# EAGLE design smd-v1 (EAGLE 5.11)

## Sheet 1 of 2
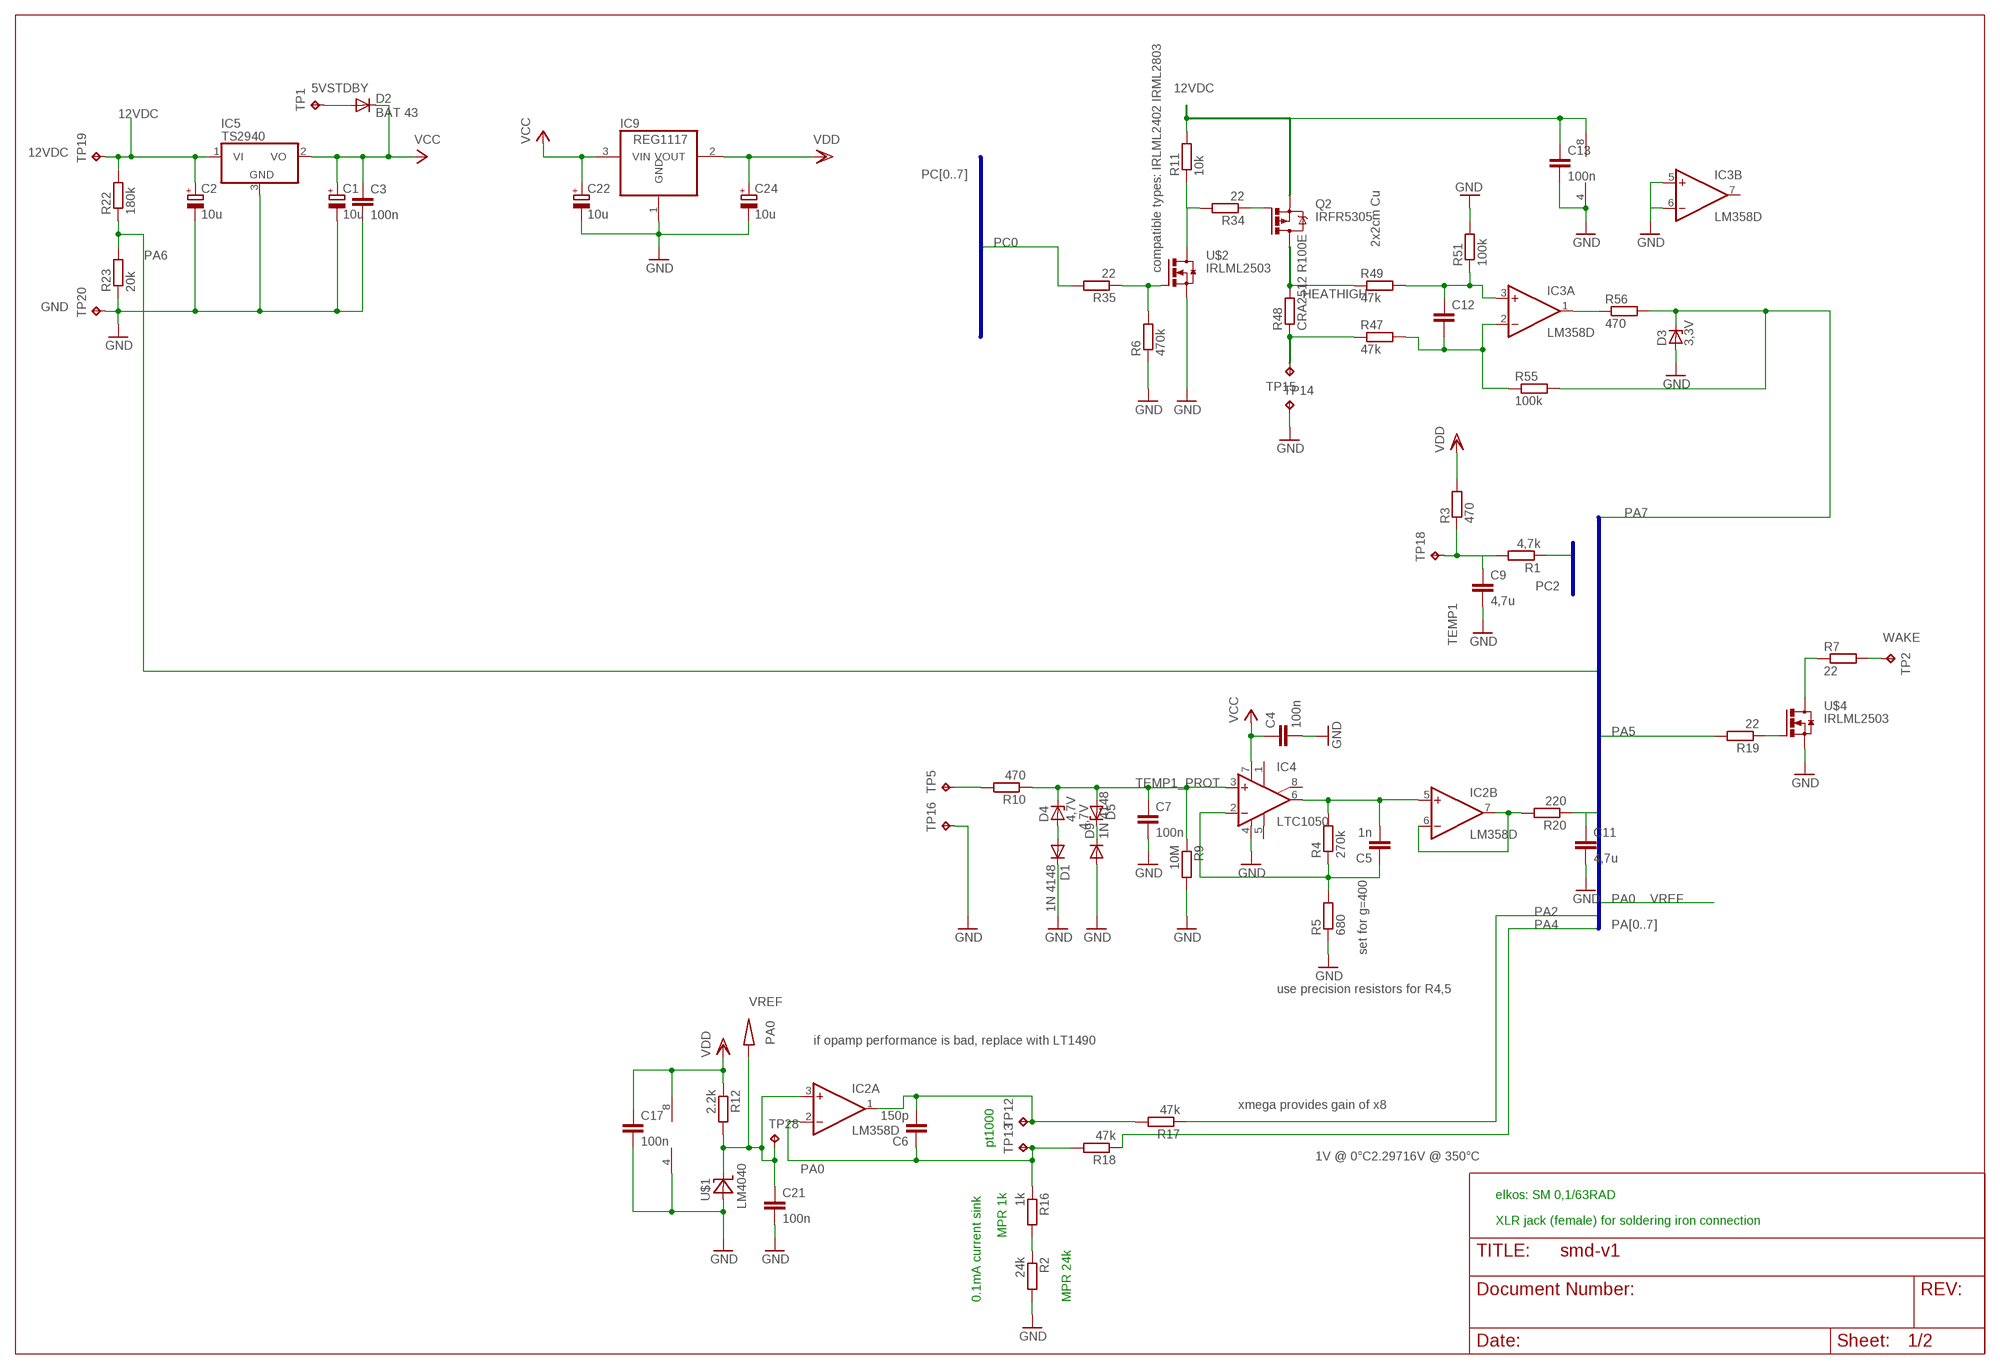
[diagram p0: schematic, sheet 1]

### Parts
C1  10u  CPOL-EUC/6032-28R  [C/6032-28R]
C2  10u  CPOL-EUC/6032-28R  [C/6032-28R]
C3  100n  C-EUC0805  [C0805]
C4  100n  C-EUC0805  [C0805]
C5  1n  C-EUC0805  [C0805]
C6  150p  C-EUC0805  [C0805]
C7  100n  C-EUC0805  [C0805]
C9  4,7u  C-EUC0805  [C0805]
C11  4,7u  C-EUC0805  [C0805]
C12  C-EUC0603  [C0603]
C13  100n  C-EUC0805  [C0805]
C17  100n  C-EUC0805  [C0805]
C21  100n  C-EUC0805  [C0805]
C22  10u  CPOL-EUC/6032-28R  [C/6032-28R]
C24  10u  CPOL-EUC/6032-28R  [C/6032-28R]
D1  1N 4148  DIODE-MINIMELF  [MINIMELF]
D2  BAT 43  DIODE-MINIMELF  [MINIMELF]
D3  3,3V  ZENER-DIODESOT23  [SOT23]
D4  4,7V  ZENER-DIODESOD80C  [SOD80C]
D5  4,7V  ZENER-DIODESOD80C  [SOD80C]
D9  1N 4148  DIODE-MINIMELF  [MINIMELF]
IC2  LM358D  [SO08]
IC3  LM358D  [SO08]
IC4  LTC1050  LM101D  [SO08]
IC5  TS2940  7805DT  [TO252]
IC9  REG1117  [SOT223]
Q2  IRFR5305  [D-PAK_TO252AA]
R1  4,7k  R-EU_R0805  [R0805]
R2  24k  R-EU_R0805  [R0805]
R3  470  R-EU_R0805  [R0805]
R4  270k  R-EU_R0805  [R0805]
R5  680  R-EU_R0805  [R0805]
R6  470k  R-EU_R0805  [R0805]
R7  22  R-EU_R0805  [R0805]
R9  10M  R-EU_R0805  [R0805]
R10  470  R-EU_R0805  [R0805]
R11  10k  R-EU_R0805  [R0805]
R12  2.2k  R-EU_R0805  [R0805]
R16  1k  R-EU_R0805  [R0805]
R17  47k  R-EU_R0805  [R0805]
R18  47k  R-EU_R0805  [R0805]
R19  22  R-EU_R0805  [R0805]
R20  220  R-EU_R0805  [R0805]
R22  180k  R-EU_R0805  [R0805]
R23  20k  R-EU_R0805  [R0805]
R34  22  R-EU_R0805  [R0805]
R35  22  R-EU_R0805  [R0805]
R47  47k  R-EU_R0603  [R0603]
R48  CRA2512 R100E  R-EU_R2512  [R2512]
R49  47k  R-EU_R0603  [R0603]
R51  100k  R-EU_R0603  [R0603]
R55  100k  R-EU_R0603  [R0603]
R56  470  R-EU_R0603  [R0603]
TP1  TPTP20SQ  [TP20SQ]
TP2  TPTP20SQ  [TP20SQ]
TP5  TPTP20SQ  [TP20SQ]
TP12  TPTP20SQ  [TP20SQ]
TP13  TPTP20SQ  [TP20SQ]
TP14  TPTP20SQ  [TP20SQ]
TP15  TPTP20SQ  [TP20SQ]
TP16  TPTP20SQ  [TP20SQ]
TP18  TPTP20SQ  [TP20SQ]
TP19  TPTP20SQ  [TP20SQ]
TP20  TPTP20SQ  [TP20SQ]
TP28  TPTP20SQ  [TP20SQ]
U$1  LM4040  [SOT23]
U$2  IRLML2503  [MICRO3]
U$4  IRLML2503  [MICRO3]

### Nets
12VDC: C2.+ C13.1 IC3.8(P:V+) IC5.1(VI) Q2.3(S) R11.2 R22.2 TP19.TP
GND: C1.- C2.- C3.2 C4.2 C7.2 C9.2 C11.2 C13.2 C17.2 C21.2 C22.- C24.- D1.C D3.1(A) D9.A IC2.4(P:V-) IC3.4(P:V-) IC3.5(B:+IN) IC3.6(B:-IN) IC4.4(V-) IC5.3(GND) IC9.1(GND) R2.2 R5.1 R6.1 R9.2 R23.1 R51.2 TP14.TP TP16.TP TP20.TP U$1.2(A) U$2.2(S) U$4.2(S) ; also sheet 2
HEATHIGH: Q2.4(D) R48.2 R49.1
N$2: R11.1 R34.2 U$2.3(D)
N$4: C6.2 IC2.1(A:OUT) R17.2 TP12.TP
N$5: R2.1 R16.2
N$6: D1.A D4.A
N$7: R7.1 U$4.3(D)
N$8: R19.1 U$4.1(G)
N$10: Q2.1(G) R34.1
N$12: C6.1 IC2.2(A:-IN) R16.1 R18.2 TP13.TP
N$13: D5.C D9.C
N$14: D2.A TP1.TP
N$15: C5.1 IC4.2(-IN) R4.1 R5.2
N$34: R6.2 R35.1 U$2.1(G)
N$066: R47.1 R48.1 TP15.TP
N$067: C12.1 IC3.3(A:+IN) R49.2 R51.1
N$068: C12.2 IC3.2(A:-IN) R47.2 R55.1
N$073: IC3.1(A:OUT) R56.1
N$075: IC2.6(B:-IN) IC2.7(B:OUT) R20.2
N$085: C5.2 IC2.5(B:+IN) IC4.6(OUT) R4.2
PA0: C21.1 IC2.3(A:+IN) R12.2 TP28.TP U$1.1(C) ; supply symbol labelled MARKER_OUTPUT ; also sheet 2
PA1: C11.1 R20.1 ; also sheet 2
PA2: R17.1 ; also sheet 2
PA4: R18.1 ; also sheet 2
PA5: R19.2 ; also sheet 2
PA6: R22.1 R23.2 ; also sheet 2
PA7: D3.3(C) R55.2 R56.2 ; also sheet 2
PC0: R35.2 ; also sheet 2
PC2: R1.1 ; also sheet 2
TEMP1: R10.2 TP5.TP
TEMP1_PROT: C7.1 D4.C D5.A IC4.3(+IN) R9.1 R10.1
TRAY1: C9.1 R1.2 R3.1 TP18.TP
VCC: C1.+ C3.1 C4.1 C22.+ D2.C IC4.7(V+) IC5.2(VO) IC9.3(VIN) ; also sheet 2
VDD: C17.1 C24.+ IC2.8(P:V+) IC9.2(VOUT) R3.2 R12.1 ; also sheet 2
WAKEXXX: R7.2 TP2.TP
Unconnected: IC3.7(B:OUT) IC4.1(ON1) IC4.5(OPT) IC4.8(ON2)

### Buses
PA[0..7]
PC[0..7]
PC2

### Notes on the sheet
- 5VSTDBY
- 12VDC
- 2x2cm Cu
- compatible types: IRLML2402 IRML2803
- GND
- WAKE
- VREF
- set for g=400
- use precision resistors for R4,5
- VREF
- if opamp performance is bad, replace with LT1490
- xmega provides gain of x8
- pt1000
- 1V @ 0°C2.29716V @ 350°C
- elkos: SM 0,1/63RAD
- XLR jack (female) for soldering iron connection
- MPR 1k
- 0.1mA current sink | MPR 24k

## Sheet 2 of 2
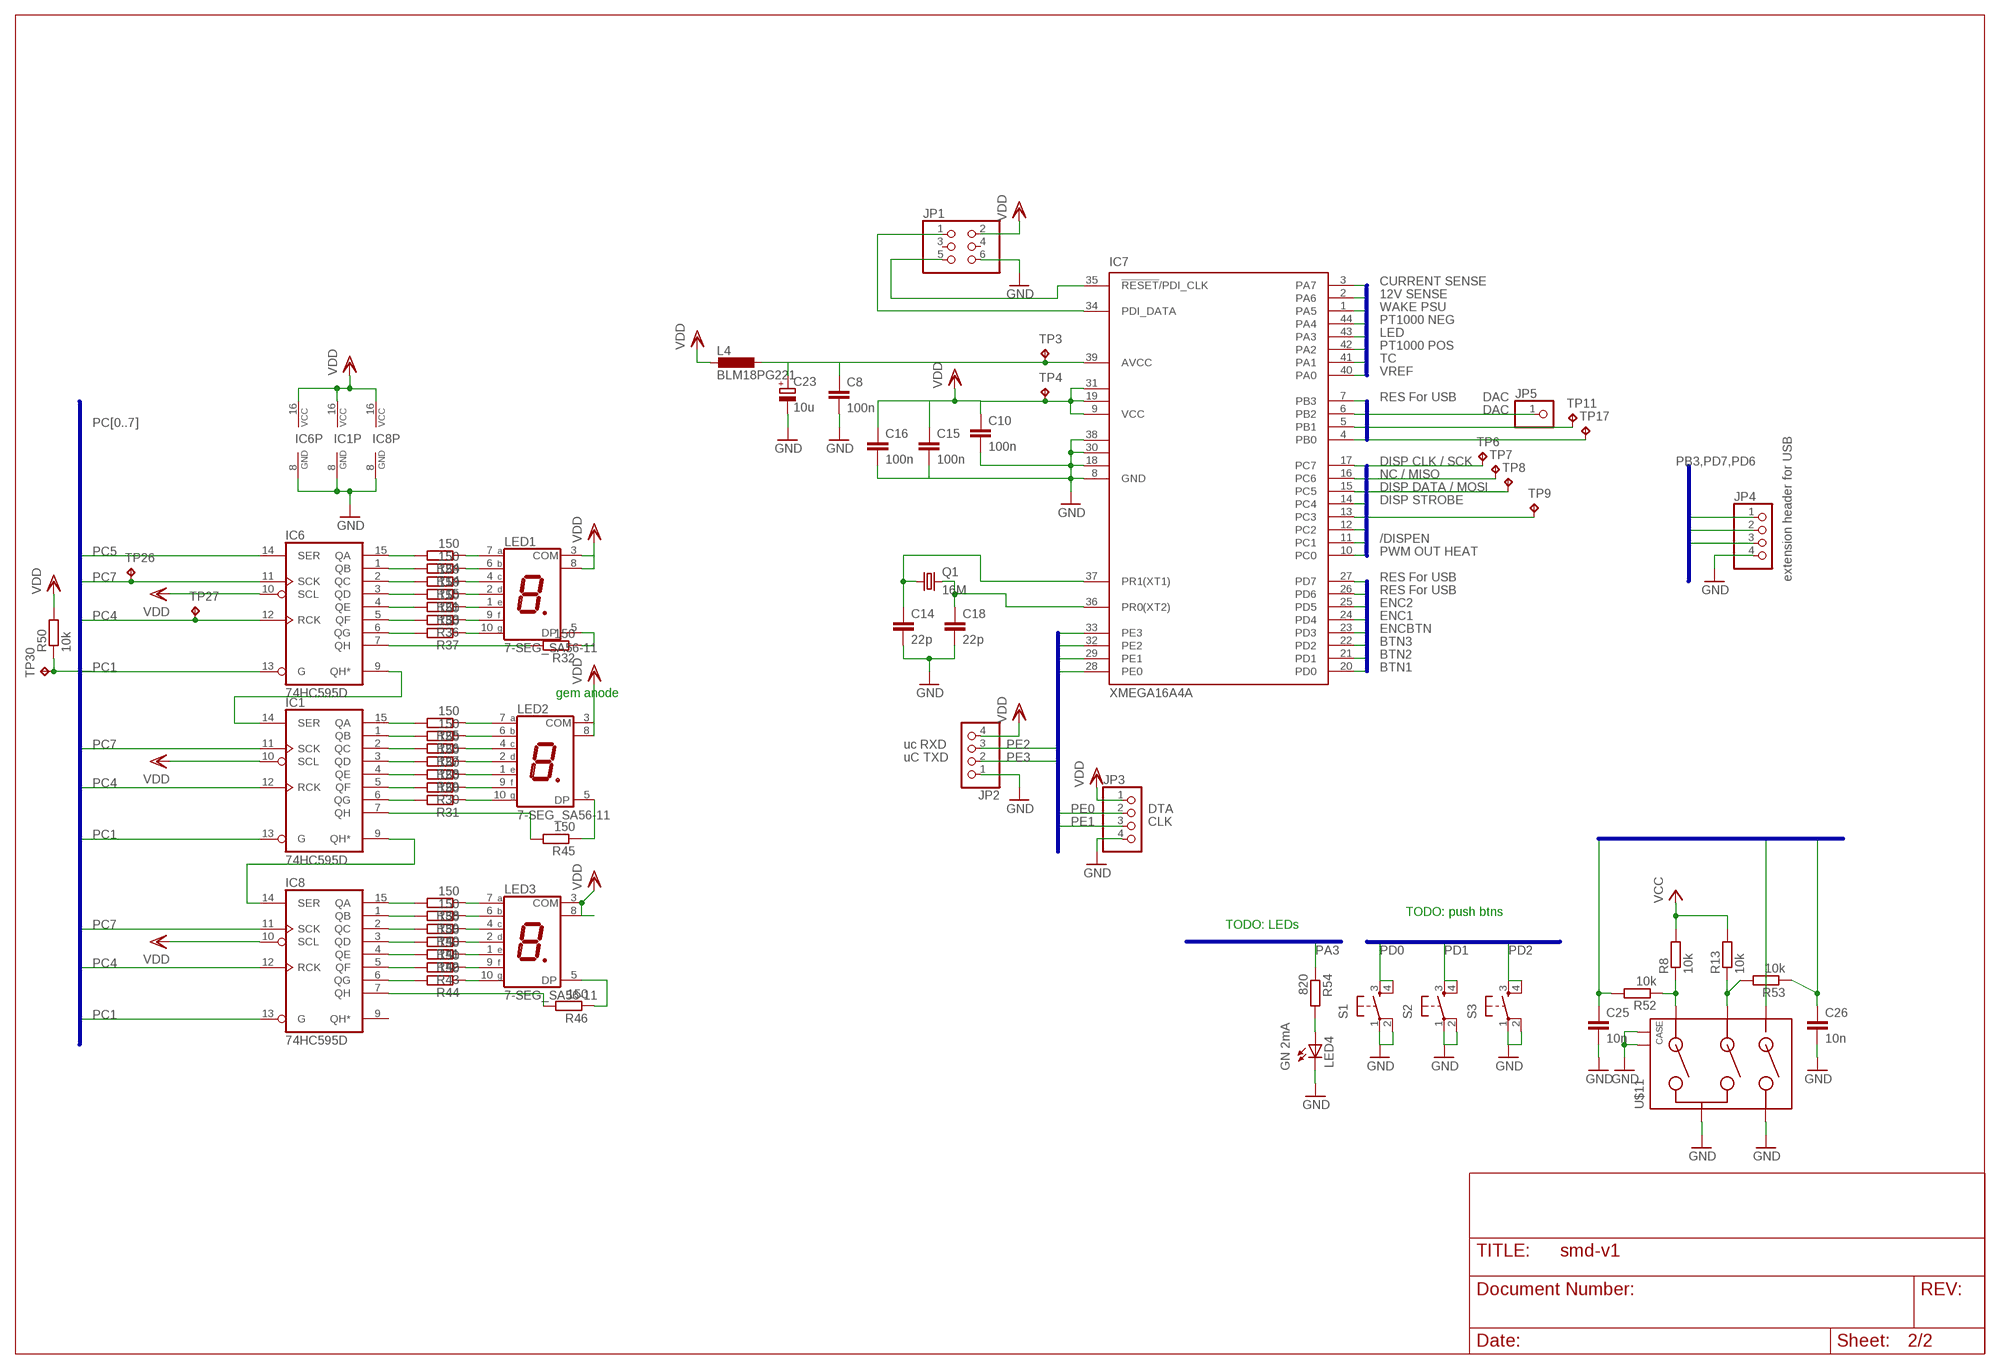
[diagram p1: schematic, sheet 2]

### Parts
C8  100n  C-EUC0603  [C0603]
C10  100n  C-EUC0603  [C0603]
C14  22p  C-EUC0805  [C0805]
C15  100n  C-EUC0603  [C0603]
C16  100n  C-EUC0603  [C0603]
C18  22p  C-EUC0805  [C0805]
C23  10u  CPOL-EU153CLV-0405  [153CLV-0405]
C25  10n  C-EUC0603  [C0603]
C26  10n  C-EUC0603  [C0603]
IC1  74HC595D  [SO16]
IC6  74HC595D  [SO16]
IC7  XMEGA16A4A  [TQFP44]
IC8  74HC595D  [SO16]
JP1  PINHD-2X3  [2X03]
JP2  PINHD-1X4  [1X04]
JP3  PINHD-1X4  [1X04]
JP4  PINHD-1X4  [1X04]
JP5  PINHD-1X1  [1X01]
L4  BLM18PG221  L-EUL0603  [L0603]
LED1  7-SEG_SA56-11  [SA56-11]
LED2  7-SEG_SA56-11  [SA56-11]
LED3  7-SEG_SA56-11  [SA56-11]
LED4  LEDCHIP-LED0603  [CHIP-LED0603]
Q1  16M  CRYSTALHC49UP  [HC49UP]
R8  10k  R-EU_R0603  [R0603]
R13  10k  R-EU_R0603  [R0603]
R14  150  R-EU_R0805  [R0805]
R15  150  R-EU_R0805  [R0805]
R21  150  R-EU_R0805  [R0805]
R24  150  R-EU_R0805  [R0805]
R25  150  R-EU_R0805  [R0805]
R26  150  R-EU_R0805  [R0805]
R27  150  R-EU_R0805  [R0805]
R28  150  R-EU_R0805  [R0805]
R29  150  R-EU_R0805  [R0805]
R30  150  R-EU_R0805  [R0805]
R31  150  R-EU_R0805  [R0805]
R32  150  R-EU_R0805  [R0805]
R33  150  R-EU_R0805  [R0805]
R36  150  R-EU_R0805  [R0805]
R37  150  R-EU_R0805  [R0805]
R38  150  R-EU_R0805  [R0805]
R39  150  R-EU_R0805  [R0805]
R40  150  R-EU_R0805  [R0805]
R41  150  R-EU_R0805  [R0805]
R42  150  R-EU_R0805  [R0805]
R43  150  R-EU_R0805  [R0805]
R44  150  R-EU_R0805  [R0805]
R45  150  R-EU_R0805  [R0805]
R46  150  R-EU_R0805  [R0805]
R50  10k  R-EU_R0805  [R0805]
R52  10k  R-EU_R0603  [R0603]
R53  10k  R-EU_R0603  [R0603]
R54  820  R-EU_R0603  [R0603]
S1  10-XXB3FRAFI  [RAFI]
S2  10-XXB3FRAFI  [RAFI]
S3  10-XXB3FRAFI  [RAFI]
TP3  TPTP20SQ  [TP20SQ]
TP4  TPTP20SQ  [TP20SQ]
TP6  TPTP20SQ  [TP20SQ]
TP7  TPTP20SQ  [TP20SQ]
TP8  TPTP20SQ  [TP20SQ]
TP9  TPTP20SQ  [TP20SQ]
TP11  TPTP20SQ  [TP20SQ]
TP17  TPTP20SQ  [TP20SQ]
TP26  TPTP20SQ  [TP20SQ]
TP27  TPTP20SQ  [TP20SQ]
TP30  TPTP20SQ  [TP20SQ]
U$11  STEC12E  [STEC12]

### Nets
FOO: C8.1 C23.+ IC7.39(AVCC) L4.1 TP3.TP
GND: C8.2 C10.2 C14.2 C15.2 C16.2 C18.2 C23.- C25.2 C26.2 IC1.8(GND) IC6.8(GND) IC7.8(GND) IC7.18(GND1) IC7.30(GND2) IC7.38(GND3) IC8.8(GND) JP1.6 JP2.1 JP3.4 JP4.4 LED4.C S1.1(P) S1.2(P1) S2.1(P) S2.2(P1) S3.1(P) S3.2(P1) U$11.P$2 U$11.P$5 U$11.P$6(CASE) U$11.P$7(CASE1) ; also sheet 1
N$1: R8.1 R52.1 U$11.P$1
N$3: IC6.15(QA) R24.2
N$11: LED2.5(DP) R45.1
N$16: IC1.15(QA) R25.2
N$17: C18.1 IC7.36(PR0(XT2)) Q1.2
N$18: IC1.1(QB) R26.2
N$19: C14.1 IC7.37(PR1(XT1)) Q1.1
N$20: IC1.2(QC) R27.2
N$21: IC1.3(QD) R28.2
N$22: IC1.4(QE) R29.2
N$23: IC1.5(QF) R30.2
N$24: IC1.6(QG) R31.2
N$25: IC1.7(QH) R45.2
N$26: LED2.7(A) R25.1
N$27: LED2.6(B) R26.1
N$28: LED2.4(C) R27.1
N$29: LED2.2(D) R28.1
N$30: LED2.1(E) R29.1
N$31: LED2.9(F) R30.1
N$32: LED2.10(G) R31.1
N$33: IC6.1(QB) R14.2
N$35: IC6.2(QC) R15.2
N$36: IC6.3(QD) R21.2
N$37: IC6.4(QE) R33.2
N$38: IC6.5(QF) R36.2
N$39: IC6.6(QG) R37.2
N$40: IC6.7(QH) R32.2
N$41: LED1.7(A) R24.1
N$42: LED1.6(B) R14.1
N$43: LED1.4(C) R15.1
N$44: LED1.2(D) R21.1
N$45: LED1.1(E) R33.1
N$46: LED1.9(F) R36.1
N$47: LED1.10(G) R37.1
N$48: IC8.15(QA) R38.2
N$49: IC8.1(QB) R39.2
N$50: IC8.2(QC) R40.2
N$51: IC8.3(QD) R41.2
N$52: IC8.4(QE) R42.2
N$53: IC8.5(QF) R43.2
N$54: IC8.6(QG) R44.2
N$55: IC8.7(QH) R46.2
N$56: LED3.7(A) R38.1
N$57: LED3.6(B) R39.1
N$58: LED3.4(C) R40.1
N$59: LED3.2(D) R41.1
N$60: LED3.1(E) R42.1
N$61: LED3.9(F) R43.1
N$62: LED3.10(G) R44.1
N$63: LED3.5(DP) R46.1
N$64: LED1.5(DP) R32.1
N$65: R13.1 R53.2 U$11.P$3
N$69: IC1.14(SER) IC6.9(QH*)
N$70: IC1.9(QH*) IC8.14(SER)
N$74: LED4.A R54.2
N$077: IC7.34(PDI_DATA) JP1.1
N$078: IC7.35(!RESET!/PDI_CLK) JP1.5
PA0: IC7.40(PA0) ; also sheet 1
PA1: IC7.41(PA1) ; also sheet 1
PA2: IC7.42(PA2) ; also sheet 1
PA3: IC7.43(PA3) R54.1
PA4: IC7.44(PA4) ; also sheet 1
PA5: IC7.1(PA5) ; also sheet 1
PA6: IC7.2(PA6) ; also sheet 1
PA7: IC7.3(PA7) ; also sheet 1
PB0: IC7.4(PB0) TP17.TP
PB1: IC7.5(PB1) TP11.TP
PB2: IC7.6(PB2) JP5.1
PB3: IC7.7(PB3) JP4.1
PC0: IC7.10(PC0) ; also sheet 1
PC1: IC1.13(G) IC6.13(G) IC7.11(PC1) IC8.13(G) R50.1 TP30.TP
PC2: IC7.12(PC2) ; also sheet 1
PC3: IC7.13(PC3) TP9.TP
PC4: IC1.12(RCK) IC6.12(RCK) IC7.14(PC4) IC8.12(RCK) TP27.TP
PC5: IC6.14(SER) IC7.15(PC5) TP8.TP
PC6: IC7.16(PC6) TP7.TP
PC7: IC1.11(SCK) IC6.11(SCK) IC7.17(PC7) IC8.11(SCK) TP6.TP TP26.TP
PD0: IC7.20(PD0) S1.3(S) S1.4(S1)
PD1: IC7.21(PD1) S2.3(S) S2.4(S1)
PD2: IC7.22(PD2) S3.3(S) S3.4(S1)
PD3: IC7.23(PD3) U$11.P$4
PD4: C25.1 IC7.24(PD4) R52.2
PD5: C26.1 IC7.25(PD5) R53.1
PD6: IC7.26(PD6) JP4.3
PD7: IC7.27(PD7) JP4.2
PE0: IC7.28(PE0) JP3.2
PE1: IC7.29(PE1) JP3.3
PE2: IC7.32(PE2) JP2.3
PE3: IC7.33(PE3) JP2.2
VCC: R8.2 R13.2 ; also sheet 1
VDD: C10.1 C15.1 C16.1 IC1.10(SCL) IC1.16(VCC) IC6.10(SCL) IC6.16(VCC) IC7.9(VCC) IC7.19(VCC1) IC7.31(VCC2) IC8.10(SCL) IC8.16(VCC) JP1.2 JP2.4 JP3.1 L4.2 LED1.3(COM) LED1.8(COM) LED2.3(COM) LED2.8(COM) LED3.3(COM) LED3.8(COM) R50.2 TP4.TP ; also sheet 1
Unconnected: IC8.9(QH*) JP1.3 JP1.4

### Buses
PA[0..7]
PD[0..7]
PB[0..3]
PC[0..7]
PE[0..3]
PB3,PD7,PD6

### Notes on the sheet
- CURRENT SENSE
- 12V SENSE
- WAKE PSU
- PT1000 NEG
- LED
- PT1000 POS
- TC
- VREF
- RES For USB | DAC
- DAC
- DISP CLK / SCK
- NC / MISO
- DISP DATA / MOSI
- DISP STROBE
- /DISPEN
- PWM OUT HEAT
- RES For USB | extension header for USB
- RES For USB
- ENC2
- ENC1
- ENCBTN
- BTN3
- BTN2
- BTN1
- gem anode
- uc RXD
- uC TXD
- DTA
- CLK
- TODO: push btns
- TODO: LEDs
- GN 2mA

## Library data of the parts
C1 C2 C22-C24 = rcl:CPOL-EU: POLARIZED CAPACITOR, European symbol
C3-C7 C9 C11 C13 C14 C17 C18 C21 = rcl:C-EU: CAPACITOR, European symbol
C8 C10 C12 C15 C16 C25 C26 = resistor:C-EU: CAPACITOR, European symbol
D1 D2 D9 = diode:DIODE-: DIODE
D3-D5 = diode:ZENER-DIODE: Z-Diode
IC1 IC6 IC8 = 74xx-eu:74*595: 8-bit SHIFT REGISTER, output latch
IC2 IC3 = linear:LM358: OP AMP also LM158; LM258; LM2904 Source: http://cache.national.com/ds/LM/LM158.pdf
IC4 = linear:LM101: OP AMP
IC5 = linear:78*: Positive VOLTAGE REGULATOR Source: http://cache.national.com/ds/LM/LM78L05.pdf http://www.fairchildsemi.com/ds/LM/LM7805.pdf
IC7 = atmel:XMEGA16A4: MICROCONTROLLER Features High-performance, Low-power 8/16-bit AVR XMEGA Microcontroller Non-Volatile Program and Data Memories - 16 KB - 128 KB of In-System Self-Programmable Flash - 4 KB - 8 KB Boot Code Section with Independent Lock Bits - 1 KB - 2 KB EEPROM - 2 KB - 8 KB Internal SRAM Peripheral Features - Four-channel DMA Controller with support for external requests - Eight-channel Event System - Five 16-bit Timer/Counters Three Timer/Counters with 4 Output Compare or Input Capture channels Two Timer/Counters with 2 Output Compare or Input Capture channels High-Resolution Extensions on all Timer/Counters Advanced Waveform Extension on one Timer/Counter - Five USARTs IrDA Extension on one USART - Two Two-Wire Interfaces with dual address match (I2C and SMBus compatible) - Two SPIs (Serial Peripheral Interfaces) peripherals - AES and DES Crypto Engine - 16-bit Real Time Counter with Separate Oscillator - One Twelve-channel, 12-bit, 2 Msps Analog to Digital Converter - One Two-channel, 12-bit, 1 Msps Digital to Analog Converter - Two Analog Comparators with Window compare function - External Interrupts on all General Purpose I/O pins - Programmable Watchdog Timer with Separate On-chip Ultra Low Power Oscillator Special Microcontroller Features - Power-on Reset and Programmable Brown-out Detection - Internal and External Clock Options with PLL - Programmable Multi-level Interrupt Controller - Sleep Modes: Idle, Power-down, Standby, Power-save, Extended Standby - Advanced Programming, Test and Debugging Interfaces PDI (Program and Debug Interface) for programming, test and debugging I/O and Packages - 34 Programmable I/O Lines - 44 - lead TQFP - 44 - pad VQFN/QFN - 49 - ball VFBGA Operating Voltage - 1.6 - 3.6V Speed performance - 0 - 12 MHz @ 1.6 - 3.6V - 0 - 32 MHz @ 2.7 - 3.6V Drawn by Dipl.-Ing. (FH) Robert Siegler Created: 27.05.09; OC_FARNELL: unknown; OC_NEWARK: unknown
IC9 = burr-brown:REG1117: 800mA and 1A Low Dropout (LDO) Positive Regulator 1.8V, 2.5V, 2.85V, 3.3V, 5V, and Adj; MPN: REG1117; OC_FARNELL: 1097566; OC_NEWARK: 14P6981
JP1 = pinhead:PINHD-2X3: PIN HEADER
JP2-JP4 = pinhead:PINHD-1X4: PIN HEADER
JP5 = pinhead:PINHD-1X1: PIN HEADER
L4 = rcl:L-EU: INDUCTOR, European symbol
LED1-LED3 = display-kingbright:7-SEG_: Kingbright 14.2mm (0.56 INCH) SINGLE DIGIT NUMERIC DUISPLAY Source: SA56-11EWA(Ver1189471036.pdf; OC_FARNELL: unknown; OC_NEWARK: unknown
LED4 = led:LED: LED OSRAM: - CHIPLED LG R971, LG N971, LY N971, LG Q971, LY Q971, LO R971, LY R971 LH N974, LH R974 LS Q976, LO Q976, LY Q976 LO Q996 - Hyper CHIPLED LW Q18S LB Q993, LB Q99A, LB R99A - SideLED LS A670, LO A670, LY A670, LG A670, LP A670 LB A673, LV A673, LT A673, LW A673 LH A674 LY A675 LS A676, LA A676, LO A676, LY A676, LW A676 LS A679, LY A679, LG A679 - Hyper Micro SIDELED® LS Y876, LA Y876, LO Y876, LY Y876 LT Y87S - SmartLED LW L88C, LW L88S LB L89C, LB L89S, LG L890 LS L89K, LO L89K, LY L89K LS L896, LA L896, LO L896, LY L896 - TOPLED LS T670, LO T670, LY T670, LG T670, LP T670 LSG T670, LSP T670, LSY T670, LOP T670, LYG T670 LG T671, LOG T671, LSG T671 LB T673, LV T673, LT T673, LW T673 LH T674 LS T676, LA T676, LO T676, LY T676, LB T676, LH T676, LSB T676, LW T676 LB T67C, LV T67C, LT T67C, LS T67K, LO T67K, LY T67K, LW E67C LS E67B, LA E67B, LO E67B, LY E67B, LB E67C, LV E67C, LT E67C LW T67C LS T679, LY T679, LG T679 LS T770, LO T770, LY T770, LG T770, LP T770 LB T773, LV T773, LT T773, LW T773 LH T774 LS E675, LA E675, LY E675, LS T675 LS T776, LA T776, LO T776, LY T776, LB T776 LHGB T686 LT T68C, LB T68C - Hyper Mini TOPLED® LB M676 - Mini TOPLED Santana® LG M470 LS M47K, LO M47K, LY M47K Source: http://www.osram.convergy.de LUXEON: - LUMILED® LXK2-PW12-R00, LXK2-PW12-S00, LXK2-PW14-U00, LXK2-PW14-V00 LXK2-PM12-R00, LXK2-PM12-S00, LXK2-PM14-U00 LXK2-PE12-Q00, LXK2-PE12-R00, LXK2-PE12-S00, LXK2-PE14-T00, LXK2-PE14-U00 LXK2-PB12-K00, LXK2-PB12-L00, LXK2-PB12-M00, LXK2-PB14-N00, LXK2-PB14-P00, LXK2-PB14-Q00 LXK2-PR12-L00, LXK2-PR12-M00, LXK2-PR14-Q00, LXK2-PR14-R00 LXK2-PD12-Q00, LXK2-PD12-R00, LXK2-PD12-S00 LXK2-PH12-R00, LXK2-PH12-S00 LXK2-PL12-P00, LXK2-PL12-Q00, LXK2-PL12-R00 Source: www.luxeon.com KINGBRIGHT: KA-3528ASYC Source: www.kingbright.com
Q1 = crystal:CRYSTAL: CRYSTAL; OC_FARNELL: unknown; OC_NEWARK: unknown
Q2 = transistor-power:IRF?5305: HEXFET Power MOSFET Source: http://www.irf.com/product-info/datasheets/data/irfr5305pbf.pdf
R1-R46 R50 R52-R54 = rcl:R-EU_: RESISTOR, European symbol
R47-R49 R51 R55 R56 = resistor:R-EU_: RESISTOR, European symbol
S1-S3 = switch-omron:10-XX: OMRON SWITCH
TP1-TP9 TP11-TP20 TP26-TP28 TP30 = testpad:TP: Test pad
U$1 = custom:LM4040
U$2 U$4 = he-custom:IRLML2503
U$11 = he-custom:STEC12E

## Board
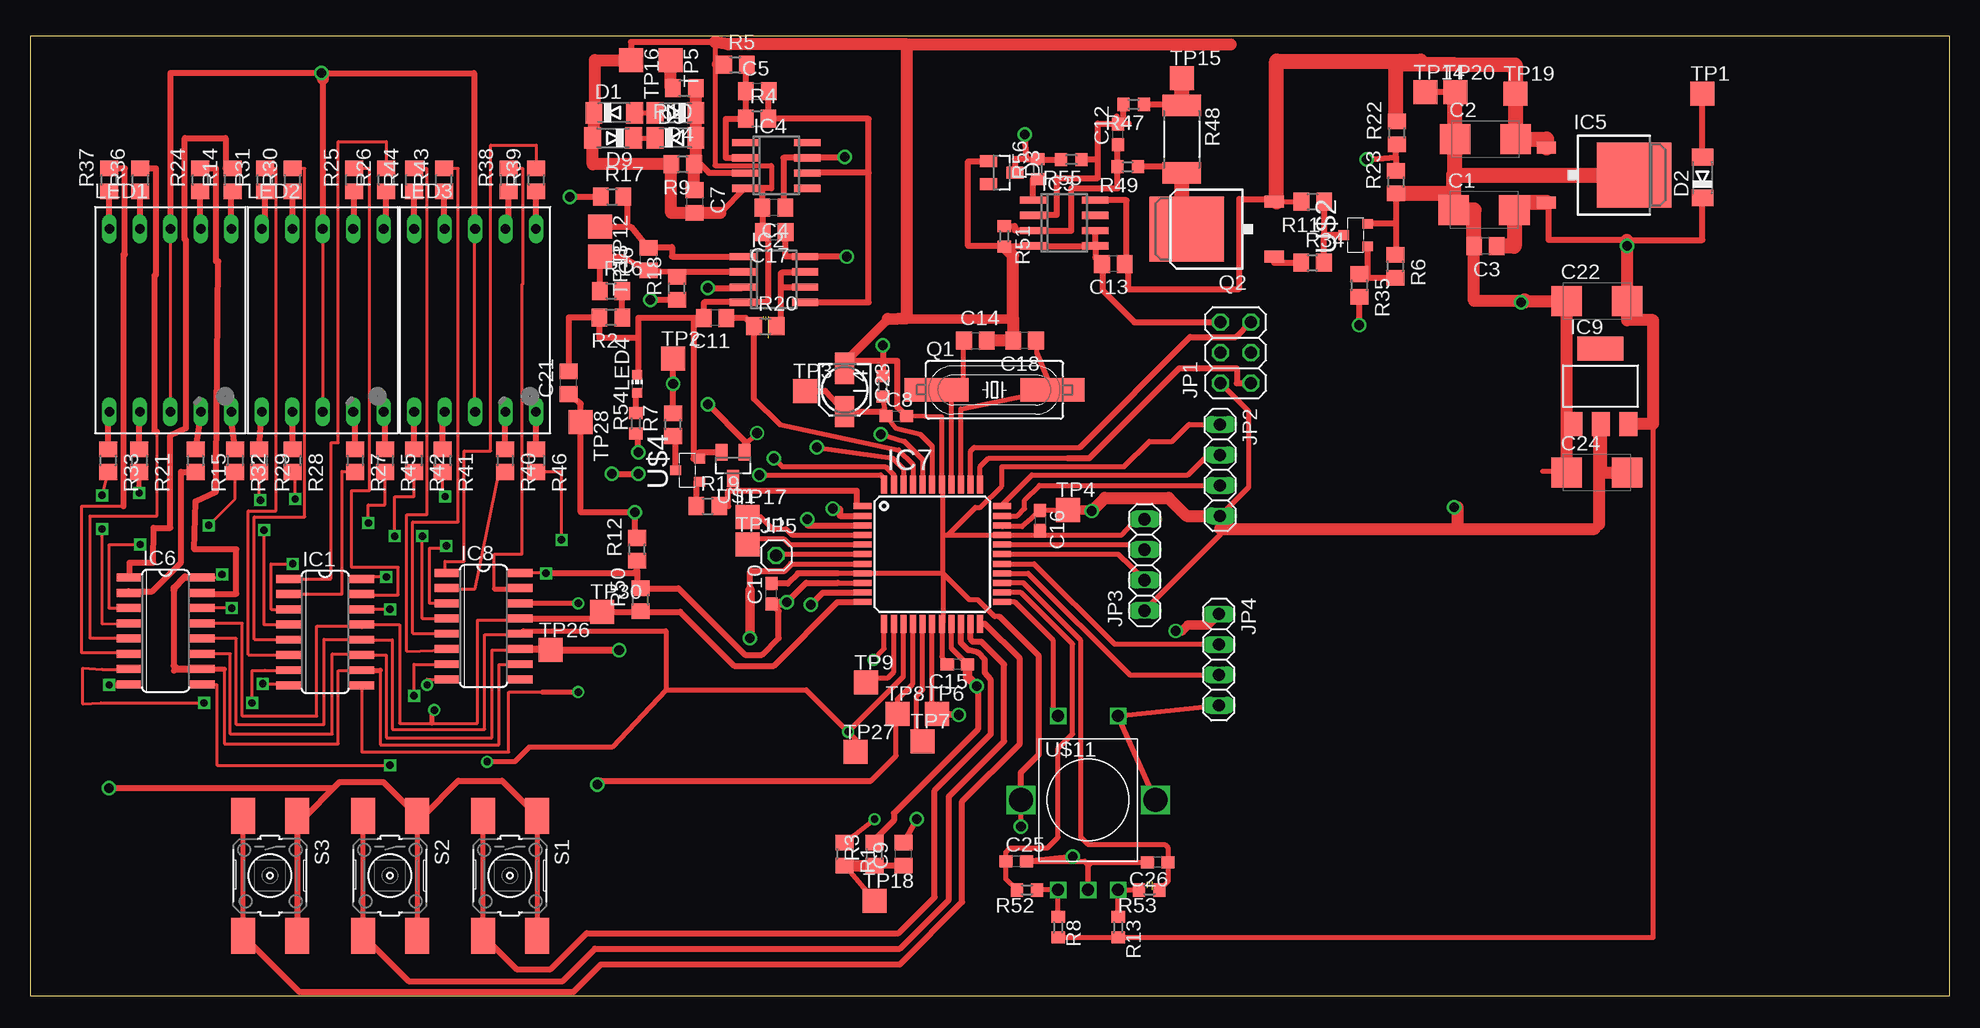
[diagram p2: board, top side]
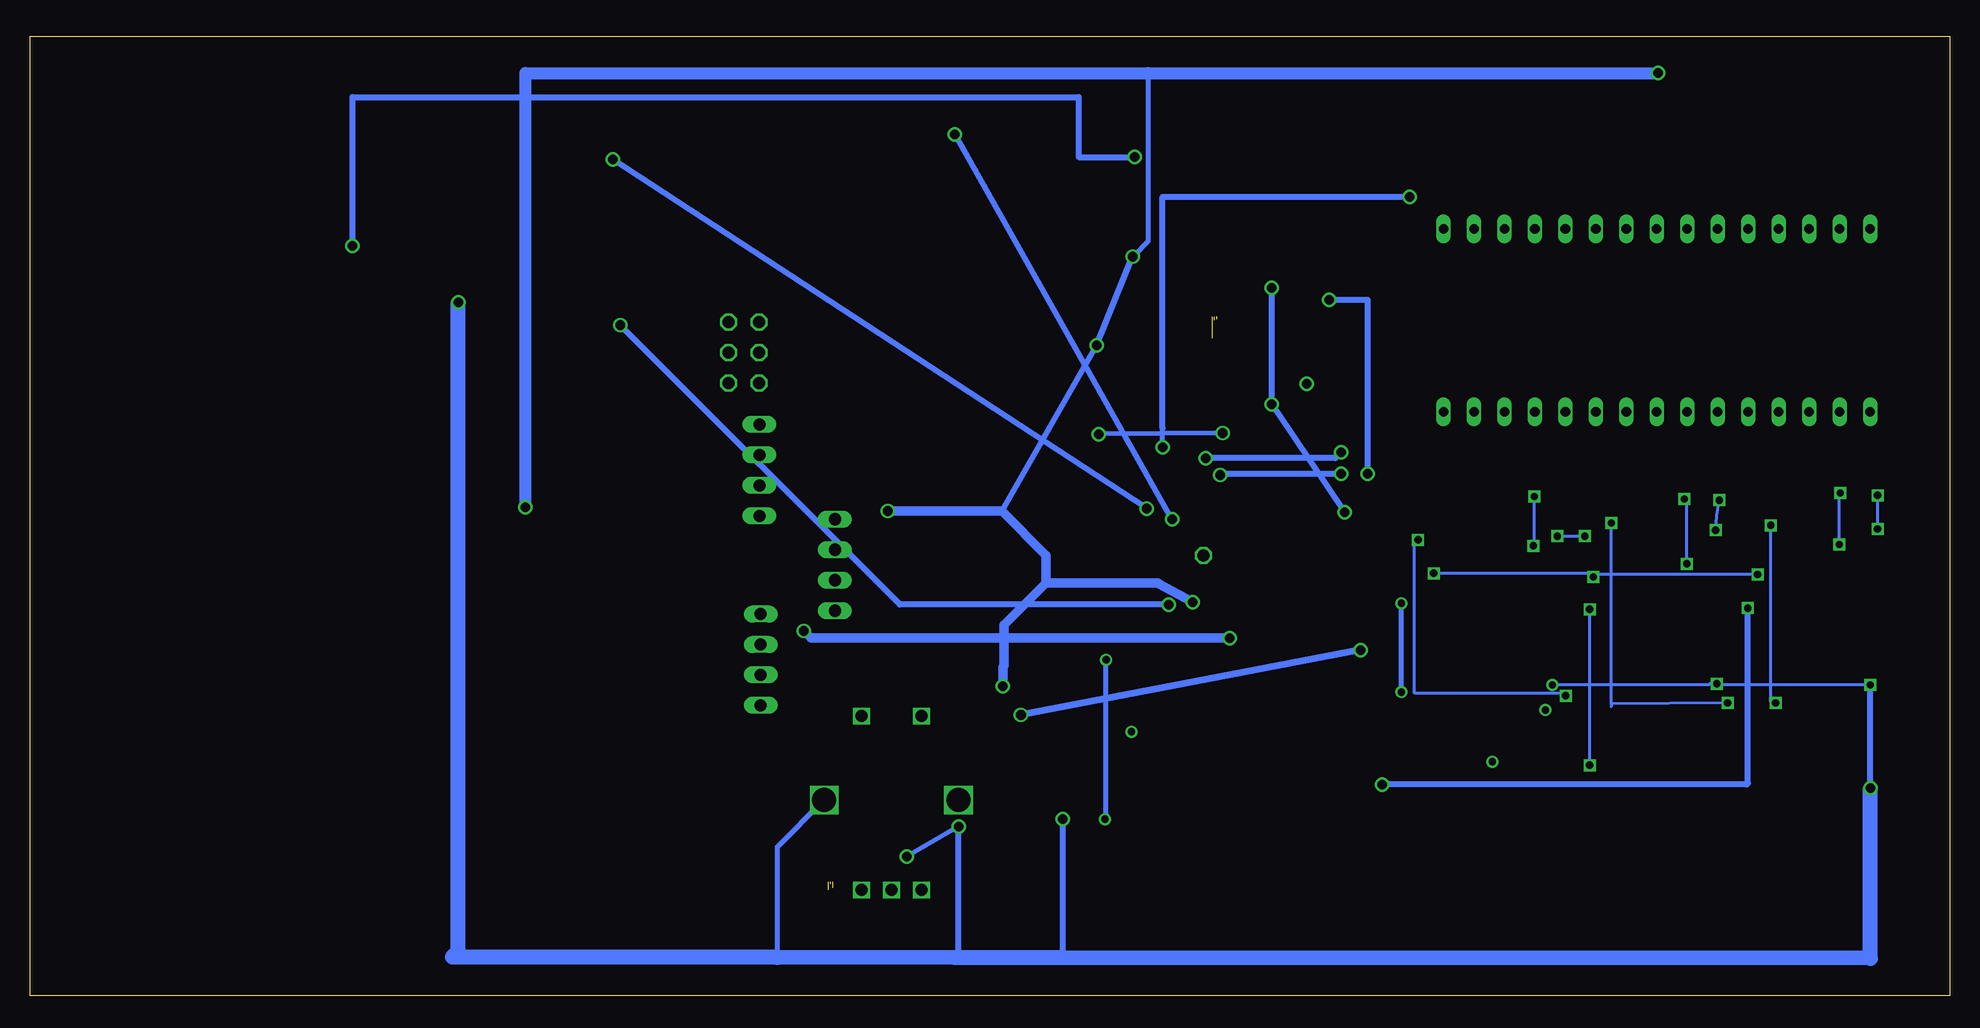
[diagram p3: board, bottom side, seen from below]

Size 160 x 80 mm. Coordinates in mm from the lower left corner, seen from the top.
Outline: 0,0 160,0 160,80 0,80 0,0
Copper layers (1*16): Top 0.035mm / dielectric 1.5mm / Bottom 0.035mm
Design rules "zwilling": minimum track width 0.2mm, minimum drill 0.5mm, track to track 0.2mm, track to pad 0.2mm, pad to pad 0.15mm, via to via 0.2mm, smd to smd 0mil, copper to edge 0.2mm, drill to drill 0.2mm, minimum pad ring 0.2mm, minimum via ring 0.2mm, stop-mask expansion 0.1mm, vias tented up to drill 0mil, thermal gap 10mil

### Footprints (pad centres in the part's own frame; a part is rotated, then mirrored left to right if it is on the bottom)
C/6032-28R = smd 2.55 x 2.5: + 2.525,0; - -2.525,0
C0805 = smd 1.3 x 1.5: 1 -0.95,0; 2 0.95,0
C0603 = smd 1.1 x 1: 1 -0.85,0; 2 0.85,0
153CLV-0405 = smd 2.6 x 1.6: + 1.8,0; - -1.8,0
MINIMELF = smd 1.4 x 1.8: A 1.7,0; C -1.7,0
SOT23 = smd 1 x 1.4: 1 -0.95,-1.1; 2 0.95,-1.1; 3 0,1.1
SOD80C = smd 1.4 x 1.8: A 1.7,0; C -1.7,0
SO16 = smd 0.66 x 2.032: 1 -4.445,-3.073; 2 -3.175,-3.073; 3 -1.905,-3.073; 4 -0.635,-3.073; 5 0.635,-3.073; 6 1.905,-3.073; 7 3.175,-3.073; 8 4.445,-3.073; 9 4.445,3.073; 10 3.175,3.073; 11 1.905,3.073; 12 0.635,3.073; 13 -0.635,3.073; 14 -1.905,3.073; 15 -3.175,3.073; 16 -4.445,3.073
SO08 = smd 0.6 x 2.2: 1 -1.905,-2.6; 2 -0.635,-2.6; 3 0.635,-2.6; 4 1.905,-2.6; 5 1.905,2.6; 6 0.635,2.6; 7 -0.635,2.6; 8 -1.905,2.6
TO252 = smd 1 x 1.6: 1 -2.28,-4.8; 2 2.28,-4.8 | smd 5.4 x 6.2: 3 0,2.5
TQFP44 = smd 1.5 x 0.5: 1 -5.8,4; 2 -5.8,3.2; 3 -5.8,2.4; 4 -5.8,1.6; 5 -5.8,0.8; 6 -5.8,0; 7 -5.8,-0.8; 8 -5.8,-1.6; 9 -5.8,-2.4; 10 -5.8,-3.2; 11 -5.8,-4; 23 5.8,-4; 24 5.8,-3.2; 25 5.8,-2.4; 26 5.8,-1.6; 27 5.8,-0.8; 28 5.8,0; 29 5.8,0.8; 30 5.8,1.6; 31 5.8,2.4; 32 5.8,3.2; 33 5.8,4 | smd 0.5 x 1.5: 12 -4,-5.8; 13 -3.2,-5.8; 14 -2.4,-5.8; 15 -1.6,-5.8; 16 -0.8,-5.8; 17 0,-5.8; 18 0.8,-5.8; 19 1.6,-5.8; 20 2.4,-5.8; 21 3.2,-5.8; 22 4,-5.8; 34 4,5.8; 35 3.2,5.8; 36 2.4,5.8; 37 1.6,5.8; 38 0.8,5.8; 39 0,5.8; 40 -0.8,5.8; 41 -1.6,5.8; 42 -2.4,5.8; 43 -3.2,5.8; 44 -4,5.8
SOT223 = smd 1.499 x 2.007: 1 -2.261,-3.15; 2 0.025,-3.15; 3 2.311,-3.15 | smd 3.81 x 2.007: 4 0,3.15
2X03 = drill 1.016 octagon: 1 -2.54,-1.27; 2 -2.54,1.27; 3 0,-1.27; 4 0,1.27; 5 2.54,-1.27; 6 2.54,1.27
1X04 = drill 1.016 long: 1 -3.81,0; 2 -1.27,0; 3 1.27,0; 4 3.81,0
1X01 = drill 1.016 octagon: 1 0,0
L0603 = smd 1 x 1.1: 1 -0.85,0; 2 0.85,0
SA56-11 = drill 0.8 long: 1 -5.08,-7.62; 2 -2.54,-7.62; 3 0,-7.62; 4 2.54,-7.62; 5 5.08,-7.62; 6 5.08,7.62; 7 2.54,7.62; 8 0,7.62; 9 -2.54,7.62; 10 -5.08,7.62
CHIP-LED0603 = smd 0.8 x 0.8: A 0,-0.75; C 0,0.75
HC49UP = smd 5.334 x 1.93: 1 -4.826,0; 2 4.826,0
D-PAK_TO252AA = smd 1 x 1.6: 1 -2.28,-4.8; 3 2.28,-4.8 | smd 5.4 x 6.2: 4 0,2.5
R0805 = smd 1.3 x 1.5: 1 -0.95,0; 2 0.95,0
R0603 = smd 1 x 1.1: 1 -0.85,0; 2 0.85,0
R2512 = smd 1.8 x 3.2: 1 -2.8,0; 2 2.8,0
RAFI = smd 3 x 2: 1 -5,2.25; 2 5,2.25; 3 -5,-2.25; 4 5,-2.25
TP20SQ = smd 2 x 2: TP 0,0
MICRO3 = smd 0.8 x 0.9: 1 -0.95,-1; 2 0.95,-1; 3 0,1
STEC12 = drill 1 square: P$1 -2.5,-7.5; P$2 0,-7.5; P$3 2.5,-7.5; P$4 -2.5,7; P$5 2.5,7 | drill 2 square: P$6 -5.6,0; P$7 5.6,0

### Placement (x,y rotation side)
C1  121.2,65.5 0 top
C2  121.3,71.4 0 top
C3  121.31,62.47 180 top
C4  62,65.7 180 top
C5  60.62,75.4 0 top
C6  51.57,61.4 90 top
C7  55.4,66.2 270 top
C8  72.2,48.3 0 top
C9  72.8,11.8 90 top
C10  61.8,33.5 90 top
C11  57.1,56.5 180 top
C12  90.7,71.8 90 top
C13  90.3,61 180 top
C14  78.8,54.6 0 top
C15  77.3,27.6 180 top
C16  84.2,39.6 270 top
C17  62.03,63.63 180 top
C18  82.9,54.6 180 top
C21  44.9,51.1 90 top
C22  130.6,57.9 0 top
C23  67.9,50.5 270 top
C24  130.6,43.6 0 top
C25  82.2,11.2 0 top
C26  94,11.1 180 top
D1  48.7,73.6 0 top
D2  139.4,68.2 90 top
D3  81,68.6 270 top
D4  53.8,73.6 180 top
D5  53.8,71.5 0 top
D9  48.6,71.5 180 top
IC1  24.6,30.3 270 top
IC2  62,59.7 270 top
IC3  86.2,64.4 270 top
IC4  62.2,69.2 270 top
IC5  131.2,68.4 270 top
IC6  11.3,30.4 270 top
IC7  75.2,36.8 0 top
IC8  37.8,30.8 270 top
IC9  130.9,50.8 0 top
JP1  100.5,53.6 90 top
JP2  99.2,43.8 270 top
JP3  92.9,35.9 90 top
JP4  99.1,28 270 top
JP5  62.2,36.7 0 top
L4  71.1,50.8 90 top
LED1  11.7,56.3 0 top
LED2  24.4,56.3 0 top
LED3  37.1,56.3 0 top
LED4  50.6,51 0 top
Q1  80.4,50.5 0 top
Q2  98.9,63.9 90 top
R1  67.9,11.8 270 top
R2  48.41,56.53 180 top
R3  70.4,11.8 90 top
R4  60.6,73.1 0 top
R5  58.8,77.6 0 top
R6  113.8,60.8 270 top
R7  53.6,47.6 90 top
R8  85.7,5.7 270 top
R9  54.4,69.3 180 top
R10  54.54,75.63 180 top
R11  106.93,66.17 180 top
R12  50.6,37.2 90 top
R13  90.7,5.7 270 top
R14  16.9,68 90 top
R15  13.8,44.6 270 top
R16  48.44,58.74 0 top
R17  48.52,66.59 0 top
R18  53.92,58.96 90 top
R19  56.5,40.8 0 top
R20  61.3,55.8 0 top
R21  9.1,44.6 270 top
R22  113.93,71.92 90 top
R23  113.87,67.81 90 top
R24  14.2,68 90 top
R25  27,68 90 top
R26  29.7,68 90 top
R27  27.1,44.6 270 top
R28  21.9,44.6 270 top
R29  19.1,44.6 270 top
R30  21.9,68 90 top
R31  19.6,68 90 top
R32  17.1,44.6 270 top
R33  6.5,44.6 270 top
R34  106.9,61.1 0 top
R35  110.8,59.2 270 top
R36  9.2,68 90 top
R37  6.6,68 90 top
R38  39.9,68 90 top
R39  42.2,68 90 top
R40  39.6,44.6 270 top
R41  34.4,44.6 270 top
R42  32,44.6 270 top
R43  34.5,68 90 top
R44  32,68 90 top
R45  29.6,44.6 270 top
R46  42.2,44.6 270 top
R47  92,74.3 180 top
R48  96,71.4 270 top
R49  91.5,69.1 180 top
R50  50.9,33 90 top
R51  81.2,63.3 270 top
R52  83.1,8.8 180 top
R53  93.3,8.8 180 top
R54  50.5,47.7 90 top
R55  86.8,69.7 180 top
R56  84,68.9 90 top
S1  40,10 270 top
S2  30,10 270 top
S3  20,10 270 top
TP1  139.4,75.2 0 top
TP2  53.6,53.1 0 top
TP3  64.6,50.4 0 top
TP4  86.5,40.5 0 top
TP5  53.4,78 270 top
TP6  75.6,23.5 0 top
TP7  74.4,21.2 0 top
TP8  72.3,23.5 0 top
TP9  69.7,26.1 0 top
TP11  59.8,37.6 0 top
TP12  47.5,64.1 270 top
TP13  47.5,61.6 270 top
TP14  116.3,75.3 0 top
TP15  96,76.5 0 top
TP16  50.1,78 270 top
TP17  59.8,39.9 0 top
TP18  70.4,7.9 0 top
TP19  123.8,75.2 0 top
TP20  118.8,75.3 0 top
TP26  43.4,28.8 0 top
TP27  68.8,20.3 0 top
TP28  45.9,47.8 270 top
TP30  47.7,32 0 top
U$1  58.6,44.2 180 top
U$2  110.5,63.4 90 top
U$4  54.8,43.8 90 top
U$11  88.2,16.3 0 top

### Tracks (layer width: path | path; a pad name or v marks a point on that pad's centre or on a via)
12VDC
  Top 0.25: TP19.TP 123.83,75.2
  Top 0.4: 113.8,72.87 R22.2 | Q2.3 103.9,66.18 103.91,66.17 R11.2 | 115.9,77.9 113.8,77.7 | 91.4,60.9 91.3,61 C13.1
  Top 0.5: IC3.8 91.4,66.31 91.4,60.9 91.5,60.9 91.5,58.9 100.8,58.9 100.8,66.4 103.7,66.4 Q2.3
  Top 1.27: 123.83,75.2 C2.+ 126.4,71.4 IC5.1 | 113.8,72.87 113.8,77.7 123.8,77.6 TP19.TP | 103.9,66.18 103.9,77.9 115.9,77.9
FOO
  Top 0.4: L4.1 C8.1 72.15,47.3 74.2,46.8 75.2,45.8 IC7.39
  Top 0.5: TP3.TP 66.3,50.4 C23.+ 70.95,48.7 C8.1
GND  (via drill 0.6, 0.8)
  Top 0.25: v19.4,26 21.53,26 IC1.8 | IC8.8 33.1,26.36 v33.1,25.9 | 118.78,75.3 TP20.TP
  Top 0.4: 118.67,68.4 118.78,68.4 | C1.- 118.67,66.86 | C15.2 76,28.25 IC7.18 76.1,31.1 76.1,35.2 | 67.35,35.2 IC7.8 76.1,35.2 | JP3.4 92.21,39.71 91,38.4 84.25,38.4 C16.2 83.85,38.4 IC7.30 76.5,38.4 | S1.1 S1.2 | S2.1 S2.2 | 88.1,11 87.9,11.2 C25.2 v86.9,11.6 | 88.1,11 88.2,10.9 U$11.P$2 88.2,10.8 88.4,11 | C26.2 88.2,11.1 88.1,11 | 76.1,38.4 76.5,38.4 | 76.1,38.4 76.1,42.5 IC7.38 76,48.25 C8.2 | 76.1,35.2 76.1,38.4 | 61.8,67.3 61.8,69.2 57.1,69.2 57.1,77.7 57.1,79.5 | v82.6,14.1 U$11.P$6 | U$11.P$7 U$11.P$5 99,24.2 JP4.4 | 126.1,43.7 128.07,43.7 C24.- | 80.8,31.6 80.4,31.6 79,33 78.3,33 76.1,35.2 | 76.5,38.4 78.8,40.7 79.2,40.7 81,42.5 81,44.1 91.2,44.1 93.3,46.2 95.2,46.2 96.61,47.61 JP2.1 | IC4.4 59.7,67.3
  Top 0.5: 113.87,64.35 U$2.2 | R23.1 113.87,64.35 | R6.1 113.87,61.75 113.87,64.35 | IC3.5 IC3.4 81.2,62.49 R51.2 81.2,62.5 78.2,62.5 78.2,69.55 D3.1 | IC3.5 IC3.6 | C8.2 72.3,49.05 72.3,52.9 68,52.9 C23.- | IC4.4 57.55,65.25 | D9.A 47,71.5 | D1.C 47.1,73.6 | 61.8,67.3 61,67.3 | 61,67.3 59.7,67.3 | 57.1,79.5 50.1,79.5 50.1,78.1 | R5.1 57.1,77.6 57.1,77.7 | 61,65.7 C4.2 | 61,67.3 61,65.7 | IC3.5 88.8,61.55 C13.2 89.4,60.95 89.4,58.8 92.06,56.14 JP1.6 | 61,65.7 61.08,65.62 C17.2 61.5,63.21 61.5,57.8 61.49,57.8 IC2.4 56.2,57.8 56.15,57.75 C11.2 55.3,56.5 | C10.2 63.15,34.35 64,35.2 67.35,35.2 | S3.2 S3.1 23,15 25.3,17.3 | 25.3,17.3 25.8,17.8 29.45,17.8 S2.1 32.8,15 35.7,17.9 39.35,17.9 S1.1 | v6.6,25.9 8.17,25.9 IC6.8 | v6.6,17.3 25.3,17.3 | C21.2 44.9,56.53 R2.2 47.46,54.8 50.7,54.8 | LED4.C 50.7,51.75 50.7,54.8 | 55.3,56.5 50.7,56.5 50.7,54.8 | U$1.2 55.8,45.3 U$4.2 55.3,44.75 55.3,56.5 | 118.78,75.3 TP14.TP | v73.9,14.7 C9.2 | U$11.P$6 82.6,18.6 84.1,20.1 84.1,28.3 80.8,31.6
  Top 0.8: 68,52.9 71.5,56.4 81.95,56.4
  Top 1: 57.55,65.25 C7.2 53.45,65.25 R9.2 46.9,69.3 D9.A | 47,71.5 D1.C | 47.1,73.6 47.1,78 TP16.TP | C3.2 120.36,57.9 124.6,57.9 C22.- 128.07,47.65 | 128.07,47.65 IC9.1 | 128.07,47.65 C24.- | C14.2 C18.2 81.95,56.4 81.95,61.7 R51.2 | JP3.4 93.89,39.71 | 73.1,79.3 58.2,79.3 57.1,79.5 | 73.1,79.3 100.1,79.3 | 73.1,79.3 73.1,56.5 71.5,56.4
  Top 1.27: 118.78,75.3 C2.- 118.78,68.4 IC5.3 | C1.- 120.36,65.5 C3.2 | R23.1 118.67,66.86 118.67,68.4 | v124.3,57.8 124.6,57.9
  Bottom 0.25: v6.6,25.9 19.4,25.9 v19.4,26 20,26 20,25.9 v33.1,25.9
  Bottom 0.4: v82.6,14.1 v86.9,11.6 | U$11.P$7 97.7,12.4 97.7,3.18
  Bottom 0.5: v6.6,17.3 v6.6,25.9 | v82.6,14.1 82.6,3.46 82.9,3.17 | 73.9,3.16 v73.9,14.7
  Bottom 1.27: v124.3,57.8 124.3,3.7 124.8,3.2 97.7,3.18 82.9,3.17 73.9,3.16 6.6,3.1 v6.6,17.3
HEATHIGH
  Top 0.4: Q2.4 96,63.9
  Top 0.5: R49.1 96,69.1 R48.2
  Top 1.27: 96,63.9 R48.2
N$1
  Top 0.4: R8.1 U$11.P$1 R52.1
N$2
  Top 0.5: R11.1 107.88,63.4 U$2.3 107.85,63.4 R34.2
N$3
  Top 0.5: R24.2 15.5,68.95 15.5,61.2 15.7,61.2 15.5,44.1 15.5,42 13.8,41.2 13.7,37.2 17.2,37.2 17.2,33.5 14.37,33.5 IC6.15
N$4
  Top 0.5: TP12.TP 49.8,64.1 | 49.8,64.1 50.1,64.1 51.45,62.45 C6.2 51.57,62.4 53.5,62.4 53.5,61.6 IC2.1 | R17.2 49.8,66.59 49.8,64.1
N$5
  Top 0.5: R16.2 49.36,58.71 R2.1
N$6
  Top 0.4: D1.A D4.A
N$7
  Top 0.5: R7.1 53.8,46.65 U$4.3
N$8
  Top 0.5: U$4.1 55.55,42.85 R19.1
N$009  (1 unrouted)
N$10
  Top 0.5: R34.1 103.7,61.1 Q2.1
N$11
  Top 0.5: LED2.5 29.6,48.68 R45.1
N$12
  Top 0.5: 54,60.34 53.66,60.34 C6.1 51.55,60.45 49.3,61.6 TP13.TP R16.1 | 54,60.34 IC2.2 | R18.2 54,59.91 54,60.34
N$13
  Top 0.4: D9.C D5.C
N$14
  Top 0.5: D2.A TP1.TP
N$15
  Top 0.5: IC4.2 58,69.83 58,73.1 R4.1 59.67,73.1 C5.1 59.67,77.6 R5.2
N$16
  Top 0.25: R25.2 28.3,68.95 28.3,42.1 26.8,42.1 26.8,35.7 30.7,35.7 30.7,33.4 27.67,33.4 IC1.15
N$17
  Top 0.4: IC7.36 77.6,48.9 Q1.2 83.93,53.6 C18.1
N$18
  Top 0.25: IC1.1 25.1,34.74 25.1,46.1 25.7,46.1 25.7,71.2 29.7,71.2 R26.2
N$19
  Top 0.4: IC7.37 76.8,50.3 Q1.1 77.8,50.4 77.8,54.8 C14.1
N$20
  Top 0.25: IC1.2 26,33.48 26,43.7 27.1,43.7 R27.2
N$21  (via drill 0.6)
  Top 0.25: R28.2 22.1,43.65 v22.1,41.4 | v21.9,36 20.1,36 20.1,32.2 IC1.3
  Bottom 0.25: v22.1,41.4 21.9,41.4 v21.9,36
N$22  (via drill 0.6)
  Top 0.25: IC1.4 19.5,30.93 v19.5,38.8 | v19.2,41.3 19.1,41.3 R29.2
  Bottom 0.25: v19.5,38.8 19.4,40 v19.2,41.3
N$23
  Top 0.25: R30.2 22.9,68.95 22.9,39.9 18.7,39.9 18.7,29.7 21.53,29.7 IC1.5
N$24
  Top 0.25: R31.2 20.5,68.95 20.5,40.4 18.2,40.4 18.2,28.4 IC1.6
N$25  (via drill 0.6)
  Top 0.25: R45.2 29.6,40.9 28.2,40.9 v28.2,39.4 | v18.5,24.4 18.5,27.1 19.6,27.1 19.6,27.12 IC1.7
  Bottom 0.25: 28.2,24.3 v28.2,39.4 | 28.2,24.3 28.2,24.1 | v18.5,24.4 28.2,24.3
N$26
  Top 0.5: LED2.7 27,63.92 R25.1
N$27
  Top 0.5: LED2.6 29.7,63.92 R26.1
N$28
  Top 0.5: LED2.4 27.1,48.68 R27.1
N$29
  Top 0.5: LED2.2 21.9,48.68 R28.1
N$30
  Top 0.5: LED2.1 19.3,48.68 R29.1
N$31
  Top 0.5: LED2.9 21.9,63.92 R30.1
N$32
  Top 0.5: LED2.10 19.6,63.92 R31.1
N$33
  Top 0.5: R14.2 16.3,68.95 16.3,71.5 12.9,71.5 12.9,63 13,63 13,47.3 11.7,46.7 11.7,39 10.3,39 10.29,36.1 8.3,36.1 8.3,34.84 IC6.1
N$34
  Top 0.5: R35.1 111.4,60.15 | 111.4,60.15 111.5,60.15 U$2.1 | R6.2 111.4,59.85 111.4,60.15
N$35
  Top 0.5: R15.2 12.6,43.65 12.6,36.11 10.19,33.7 8.23,33.7 IC6.2
N$36  (via drill 0.6)
  Top 0.25: v9.2,37.6 6.6,37.6 6.6,32.3 IC6.3
  Top 0.4: v9.1,41.9 R21.2 | IC6.3
  Bottom 0.25: v9.2,37.6 9.2,41.9
  Bottom 0.4: 9.2,41.9 v9.1,41.9
N$37  (via drill 0.6)
  Top 0.25: IC6.4 6,31 v6,38.9 | v6,41.7 R33.2
  Bottom 0.25: v6,38.9 v6,41.7
N$38
  Top 0.25: 10.6,47 10.6,40 5,40 5,29.8 8.23,29.8
  Top 0.5: R36.2 10.5,68.95 10.5,60.1 10.4,60.1 10.4,47 10.6,47 | 8.23,29.8 IC6.5
N$39
  Top 0.25: 7.8,40.8 4.3,40.8 4.3,28.6 8.23,28.6
  Top 0.5: R37.2 7.9,68.95 7.9,61.8 7.8,61.8 7.8,40.8 | 8.23,28.6 IC6.6
N$40  (via drill 0.6)
  Top 0.25: R32.2 17.1,41.4 v14.9,39.2 | v14.5,24.4 5.9,24.4 4.4,24.3 4.4,27.3 6,27.2 7.95,27.2 IC6.7
  Bottom 0.25: v14.9,39.2 14.9,24.5 v14.5,24.4
N$41
  Top 0.5: LED1.7 14.2,63.92 R24.1
N$42
  Top 0.5: R14.1 16.78,67.05 LED1.6
N$43
  Top 0.5: LED1.4 14.3,48.68 R15.1
N$44
  Top 0.5: LED1.2 9.1,48.68 R21.1
N$45
  Top 0.5: LED1.1 6.5,48.68 R33.1
N$46
  Top 0.5: LED1.9 9.2,63.92 R36.1
N$47
  Top 0.5: LED1.10 6.6,63.92 R37.1
N$48
  Top 0.25: R38.2 41.1,68.95 41.1,59.3 41,59.3 41,36.8 38.7,36.8 38.7,33.9 | 40.87,33.9 IC8.15
  Top 0.4: 38.7,33.9 40.87,33.9
N$49
  Top 0.25: R39.2 42.2,70.9 38.4,70.9 38.4,45.4 36.2,45.4 36.2,36.2 34.6,36.2 34.6,35.24 IC8.1
N$50
  Top 0.25: R40.2 39.1,43.65 37.1,33.9 34.73,33.9 IC8.2
N$51  (via drill 0.6)
  Top 0.25: IC8.3 33.3,32.7 33.3,37.3 34.7,37.3 v34.7,37.5 | v34.6,41.6 34.4,41.6 R41.2
  Bottom 0.25: v34.7,37.5 34.6,37.5 v34.6,41.6
N$52  (via drill 0.6)
  Top 0.25: IC8.4 32.7,31.43 v32.7,38.3 | v30.4,38.3 30.4,41.6 32,41.6 R42.2
  Bottom 0.25: v32.7,38.3 v30.4,38.3
N$53
  Top 0.25: R43.2 35.7,68.95 35.7,39.5 31.9,39.5 31.9,30.2 34.73,30.2 IC8.5
N$54
  Top 0.25: R44.2 33.1,68.95 33.1,40.1 31.4,40.1 31.4,28.7 34.73,28.8 IC8.6
N$55  (via drill 0.6)
  Top 0.25: R46.2 44.3,43.65 v44.3,38 | v32,25 32,27.62 IC8.7
  Bottom 0.25: v44.3,38 44.6,38 44.6,25.2 32,25.2 v32,25
N$56
  Top 0.5: LED3.7 39.9,63.92 R38.1
N$57
  Top 0.5: LED3.6 42.2,63.92 R39.1
N$58
  Top 0.5: LED3.4 39.6,48.68 R40.1
N$59
  Top 0.5: LED3.2 34.4,48.68 R41.1
N$60
  Top 0.5: LED3.1 32,48.68 R42.1
N$61
  Top 0.5: LED3.9 34.5,63.92 R43.1
N$62
  Top 0.5: LED3.10 32,63.92 R44.1
N$63
  Top 0.5: LED3.5 42.2,48.68 R46.1
N$64
  Top 0.5: LED1.5 16.7,48.68 R32.1
N$65
  Top 0.4: R13.1 U$11.P$3 R53.2
N$066
  Top 0.5: R47.1 96,74.3 R48.1
  Top 1.27: R48.1 TP15.TP
N$067
  Top 0.5: C12.1 90.65,70.95 R49.2 90.65,67.3 86.8,67.3 86.8,63.77 IC3.3 83.6,63.8 82.1,63.8 82.1,64.15 R51.1
N$068
  Top 0.5: 89,69.7 89,72.7 90.6,72.7 | 90.6,72.7 91.15,72.7 | 91.15,72.7 91.6,72.7 | 91.15,72.7 R47.2 | C12.2 90.6,72.65 90.6,72.7 | 90.6,72.7 90.6,73.3 | IC3.2 83.6,65.1 85.6,65.1 85.6,68.17 89,68.17 89,69.7 | 89,69.7 R55.1
N$69  (via drill 0.6)
  Top 0.25: IC1.14 v30,32.2 | v30,19.2 15.6,19.2 15.6,25.9 14.37,25.9 IC6.9
  Bottom 0.25: v30,19.2 v30,32.2
N$70  (via drill 0.6)
  Top 0.25: 42.7,25.3 39.9,25.3 39.9,20.3 27.67,20.3 IC1.9
  Top 0.4: IC8.14 42.7,32.7 v45.7,32.7 | 42.7,25.3 v45.7,25.3
  Bottom 0.4: v45.7,25.3 v45.7,32.7
N$071  (1 unrouted)
N$072  (1 unrouted)
N$073
  Top 0.5: R56.1 83.6,68.05 IC3.1
N$74
  Top 0.5: LED4.A 50.5,50.15 R54.2
N$075
  Top 0.5: R20.2 62.6,56.15 62.6,59.1 | 62.6,59.1 62.63,59.06 IC2.6 | IC2.7 64.56,60.3 62.7,60.3 62.6,60.2 62.6,59.1
N$076  (1 unrouted)
N$077
  Top 0.4: IC7.34 79.2,44.1 79.9,44.8 86.5,44.8 86.8,44.8
  Top 0.5: JP1.1 100.6,51.06 100.6,52.3 95.8,52.3 88.3,44.8 86.5,44.8
N$078
  Top 0.4: IC7.35 78.4,45.4 78.7,45.7 87.5,45.7
  Top 0.5: JP1.5 101.74,56.14 100.5,54.9 96.7,54.9 87.5,45.7
N$079  (1 unrouted)
N$080  (1 unrouted)
N$085
  Top 0.5: 64.8,68.5 IC4.6 64.8,68.6 69.9,68.6 | 61.57,73.1 R4.2 | 61.57,73.1 C5.2 | 61.57,73.1 69.9,73.1 69.9,68.6 | IC2.5 69.9,57.8 69.9,68.6
PA0  (via drill 0.8)
  Top 0.4: IC7.40 74.4,44.7 72.9,46.2 v70.9,46.8 | 59.55,45.9 v60.6,46.9
  Top 0.5: U$1.1 59.55,45.9 59.55,46.25 v56.5,49.3 | v56.5,59 59.34,59 IC2.3 | C21.1 45.9,49.35 TP28.TP 45.9,40.3 v50.4,40.3 50.4,38.15 R12.2
  Bottom 0.4: v60.6,46.9 v70.9,46.8
  Bottom 0.5: v56.5,59 v56.5,49.3 56,48.6 v50.4,40.3
PA1
  Top 0.4: IC7.41 73.6,44.3 72.4,45.5 62.5,47.6 60.35,49.75
  Top 0.5: 60.35,49.75 R20.1 59.65,56.5 C11.1
PA2  (via drill 0.8)
  Top 0.4: IC7.42 72.8,43.9 71.9,44.8 v65.6,45.7
  Top 0.5: R17.1 v45,66.59 v45,66.6
  Bottom 0.4: v65.6,45.7 65.6,47.3
  Bottom 0.5: v45,66.6 65.6,66.6 65.6,47.3
PA3  (via drill 0.8)
  Top 0.4: IC7.43 72,43.4 71.3,44.1 68.7,44.1 62.7,44.1 v62,44.8
  Top 0.5: R54.1 50.7,46.65 v50.7,45.3
  Bottom 0.5: v50.7,45.3 51.2,44.8 v62,44.8
PA4  (via drill 0.8)
  Top 0.4: IC7.44 71.2,43.1 70.9,43.4 v60.8,43.4
  Top 0.5: R18.1 v51.7,58.01 v51.7,58 | v48.5,43.5 v50.7,43.5
  Bottom 0.5: v60.8,43.4 60.7,43.5 v50.7,43.5 | v51.7,58 48.5,58 v48.5,43.5
PA5
  Top 0.5: R19.2 58.2,40.8 58.2,42.1 68.9,42.1 68.9,40.8 IC7.1
PA6  (via drill 0.8)
  Top 0.5: R22.1 113.87,70.97 113.87,69.9 | 113.87,69.9 R23.2 | v66.9,40.6 67.5,40.6 67.5,40 IC7.2 | v111.4,69.7 113.87,69.9
  Bottom 0.5: v66.9,40.6 v111.4,69.7
PA7  (via drill 0.8)
  Top 0.5: 83,69.75 82.1,69.75 D3.3 | 83,69.75 R56.2 84,69.7 R55.2 | IC7.3 64.8,39.2 v64.8,39.7 | v82.9,71.8 83,69.75
  Bottom 0.5: v64.8,39.7 v82.9,71.8
PB0
  Top 0.4: IC7.4 63.5,38.4 63,38.9 61.9,38.9 60.9,39.9 TP17.TP
PB1
  Top 0.4: IC7.5 63.3,37.6 62.8,38.1 60.3,38.1 TP11.TP
PB2
  Top 0.4: IC7.6 62.3,36.8 JP5.1
PB3  (via drill 0.8)
  Top 0.4: 63.4,36 IC7.7
  Top 0.5: 63.4,36 63.4,35.9 62.9,35.4 60.1,35.4 60,35.3 60,33.8
  Top 0.8: JP4.1 98.19,30.9 96.5,30.9 96,30.4 v95.5,30.4 | v60,29.8 60,33.8
  Bottom 0.8: v95.5,30.4 94.9,29.8 v60,29.8
PC0  (via drill 0.8)
  Top 0.5: IC7.10 66.1,33.6 v65.1,32.6 | v110.8,55.9 R35.2
  Bottom 0.5: v65.1,32.6 87.5,32.6 v110.8,55.9
PC1  (via drill 0.6)
  Top 0.25: IC6.13 17.7,31.04 17.7,23.3 23.9,23.3 23.9,30.8 27.67,30.8 | IC1.13 30.8,30.93 30.8,22.7 33.5,22.7 37.3,22.7 37.3,31.3 40.87,31.3 IC8.13
  Top 0.4: v33.7,23.8 33.5,23.6 33.5,22.7
  Top 0.5: 27.67,30.8 IC1.13 | IC8.13 47.7,31.43 TP30.TP | TP30.TP 54.2,32 58.7,27.5 62,27.5 67.3,32.8 IC7.11 | TP30.TP 50.85,32 R50.1
PC2  (via drill 0.6)
  Top 0.4: IC7.12 71.2,28.9 v70.3,28 | R1.1 v70.4,14.7
  Bottom 0.4: v70.3,28 70.3,14.8 v70.4,14.7
PC3
  Top 0.4: IC7.13 72,27 71.5,26.5 70.1,26.5 TP9.TP
PC4  (via drill 0.6)
  Top 0.25: IC6.12 17.2,29.77 17.2,22.6 24.5,22.6 24.5,29.7 27.67,29.7 | IC1.12 30.2,29.66 30.2,22.2 37.9,22.2 37.9,30.1 40.87,30.1 IC8.12
  Top 0.4: 40.94,30.1 IC8.12 41.11,30.4 53,30.4 53,25.5 | IC7.14 72.8,26.6 v68.2,22 | v38.1,19.5 40.4,19.5 41.6,20.7 48.5,20.7 53,25.5 | TP27.TP 68.8,21.4 v68.2,22 | v68.2,22 64.7,25.5 53,25.5
  Top 0.5: 27.67,29.7 IC1.12
PC5  (via drill 0.6, 0.8)
  Top 0.25: IC6.14 v16.8,32.3
  Top 0.4: 72.3,23.6 TP8.TP | IC7.15 73.6,26 72.3,24.7 72.3,23.6 | 72.3,23.6 72.2,23.5 72.2,20 70.1,17.9
  Top 0.5: 70.1,17.9 47.6,17.9 v47.3,17.6
  Bottom 0.5: v47.3,17.6 16.9,17.6 16.8,17.7 v16.8,32.3
PC6
  Top 0.4: IC7.16 74.4,25.5 73.9,25 73.9,21.7 TP7.TP
PC7  (via drill 0.8)
  Top 0.25: IC6.11 16.7,28.5 16.7,21.8 25.2,21.8 25.2,28.5 27.67,28.5 | IC1.11 29.7,28.39 29.7,21.5 38.5,21.5 38.5,28.8 40.87,28.8 IC8.11
  Top 0.4: 74.9,23.8 TP6.TP 75.2,23.8 IC7.17
  Top 0.5: 27.67,28.5 IC1.11
  Top 0.6: IC8.11 43.3,28.89 TP26.TP v49.1,28.8 | v77.4,23.4 TP6.TP
  Bottom 0.6: v49.1,28.8 v77.4,23.4
PD0
  Top 0.4: S1.4 S1.3
  Top 0.5: IC7.20 77.6,29.4 78.2,28.8 79,28.6 79.6,28 79.6,26.9 80.1,26.3 80.1,21.8 75.4,17.1 75.4,8.2 72.4,5.2 46.4,5.2 43.4,2.2 40.55,2.2 S1.4
PD1
  Top 0.4: S2.4 S2.3
  Top 0.5: IC7.21 78.4,29.7 78.6,29.5 79.3,29.5 81.2,27.6 81.2,21.2 76.6,16.6 76.6,8 72.5,3.9 47.1,3.9 44.4,1.2 31.55,1.2 S2.4
PD2
  Top 0.4: S3.4 S3.3
  Top 0.5: IC7.22 79.6,31 82.5,28.1 82.5,21 77.7,16.2 77.7,7.8 72.5,2.6 47.6,2.6 45.3,0.3 22.45,0.3 S3.4
PD3
  Top 0.4: U$11.P$4 85.3,23.7 85.3,29.6 82.1,32.8 IC7.23
PD4
  Top 0.4: R52.2 81.35,9.7 C25.1 81.35,11.95 81.7,12.3 84.8,12.3 85.7,13.2 85.7,20.6 86.9,21.8 86.9,29.3 82.6,33.6 IC7.24
PD5
  Top 0.4: R53.1 94.85,9.5 C26.1 94.85,12.35 94.6,12.6 88.2,12.6 87.6,13.2 87.6,29.6 82.8,34.4 IC7.25
PD6
  Top 0.4: IC7.26 83.2,35.2 91.67,26.73 JP4.3
PD7
  Top 0.4: JP4.2 99.07,29.3 90.4,29.3 83.7,36 IC7.27
PE0
  Top 0.4: IC7.28 90.7,36.8 91.2,36.3 91.23,36.3 JP3.2
PE1
  Top 0.4: IC7.29 91.5,37.6 92.1,37 92.9,37.1 JP3.3
PE2
  Top 0.4: IC7.32 82.3,40 82.9,40.6 82.9,41.3 84.13,42.53 JP2.3
PE3
  Top 0.4: IC7.33 81,40.9 83.5,43.4 96.5,43.4 98.1,45 99.13,45 JP2.2
TEMP1
  Top 1: R10.2 53.4,75.63 TP5.TP
TEMP1_PROT
  Top 0.5: IC4.3 59.56,68.6 56.6,68.6 55.9,69.3 R9.1
  Top 1: R10.1 D4.C D5.A 55.5,69.3 R9.1 55.35,67.15 C7.1
TRAY1
  Top 0.4: R1.2 TP18.TP
  Top 0.5: R1.2 C9.1
  Top 1: R3.1 70.35,10.8 R1.2
VCC  (via drill 0.8)
  Top 0.25: 123.72,66.12 C1.+
  Top 0.4: R8.2 R13.2 135.3,4.85 135.3,47.65
  Top 0.5: IC5.2 126.6,66.12 126.6,63 133.1,63 139.4,63 D2.C | v67.9,69.9 67.9,69.83 IC4.7 62.8,69.83 62.8,65.7 C4.1
  Top 1: IC9.3 135.3,47.65 135.3,56.3 133.12,56.3 C22.+ v133.12,62.5 133.12,63 133.1,63
  Top 1.27: IC5.2 123.72,66.12 | C3.1 123.72,62.47 C1.+
  Bottom 0.5: v67.9,69.9 72.6,69.9 72.6,74.9 133.12,74.9 v133.12,62.5
VDD  (via drill 0.6, 0.8)
  Top 0.25: LED1.8 LED1.3 | LED2.8 LED2.3 | LED3.3 37,48.68 37,65.8 | IC6.16 16,34.84 v16,35.1 | v29.7,34.9 28.2,34.9 28.2,34.8 27.67,34.8 IC1.16 | IC8.16 43,35.24 v43,35.2 | 16.2,27.23 16.2,21 25.7,21 25.7,27.1 27.67,27.1 IC1.10 | 29.2,27.12 29.2,20.9 39.1,20.9 39.1,27.6 40.87,27.6 IC8.10
  Top 0.4: IC6.10 16.2,27.23 | IC7.19 76.8,28.95 C15.1 | IC7.31 81.1,39.1 82.7,39.1 83.45,39.75 C16.1 86.55,40.45 TP4.TP | 67.35,34.4 IC7.9 | JP3.1 99.2,38.39 99.2,38.9 JP2.4 101.6,42.39 101.6,48.7 JP1.2 | 130.8,47.52 IC9.2 | 130.4,38.9 130.8,39.3 | IC1.10 29.2,27.12
  Top 0.5: LED1.8 11.7,76.9 v24.3,76.9 | 24.4,76.4 LED2.8 | LED3.8 37,63.92 37,65.8 37,76.9 24.4,76.9 | 67.35,34.4 64.7,34.4 v63.1,32.8 | 50.6,35.5 50.6,33.95 R50.2 54.05,33.95 59.6,28.4 61,28.4 62.4,29.8 62.4,32.05 C10.1 | 50.6,35.5 R12.1 | 43,35.24 50.34,35.24 50.6,35.5 | 12,27.1 12,27.5 12,33.8 | C17.1 62.98,61.6 IC2.8 v68.1,61.6 | v71.1,54.2 L4.2 | R3.2 70.4,13 72,14.6 72,15.2 79,22.2 79,25.7 v78.9,25.8
  Top 0.6: IC6.10 12.28,27.23 12,27.5 | 12,33.8 12,34 12.9,34.9 14.32,34.9 IC6.16
  Top 0.8: v63.1,32.8 63.05,32.75 C10.1 | v78.9,25.8 78.15,26.55 C15.1 | v88.5,40.4 88.4,40.5 TP4.TP
  Top 1: C24.+ 130.93,43.6 IC9.2 | 130.8,39.3 130.8,47.52 | 99.2,38.9 119,38.9 | 119,38.9 130.4,38.9 | v88.5,40.4 89.6,41.5 94.9,41.5 96.41,39.99 JP2.4 | v118.7,40.7 119,40.7 119,38.9 | v24.3,76.9 24.4,76.9 24.4,76.4
  Bottom 0.25: v16,35.1 29.7,35.1 v29.7,34.9 29.7,35.2 v43,35.2
  Bottom 0.4: 68,61.7 66.8,62.9 66.8,76.9
  Bottom 0.5: v68.1,61.6 v71.1,54.2 79,40.4
  Bottom 0.8: 75.3,34.4 75.2,34.5 | 75.3,34.4 66,34.4 65.9,34.3 v63.1,32.8 | 75.3,34.4 75.3,36.7 79,40.4 v88.5,40.4 | 75.3,34.4 78.8,30.9 78.8,27.5 78.9,27.4 v78.9,25.8
  Bottom 1: v24.3,76.9 66.8,76.9 118.7,76.9 v118.7,40.7
WAKEXXX  (via drill 0.8)
  Top 0.5: TP2.TP v53.6,51 R7.2